# EAGLE design LACE_mod_led (EAGLE 5.07)
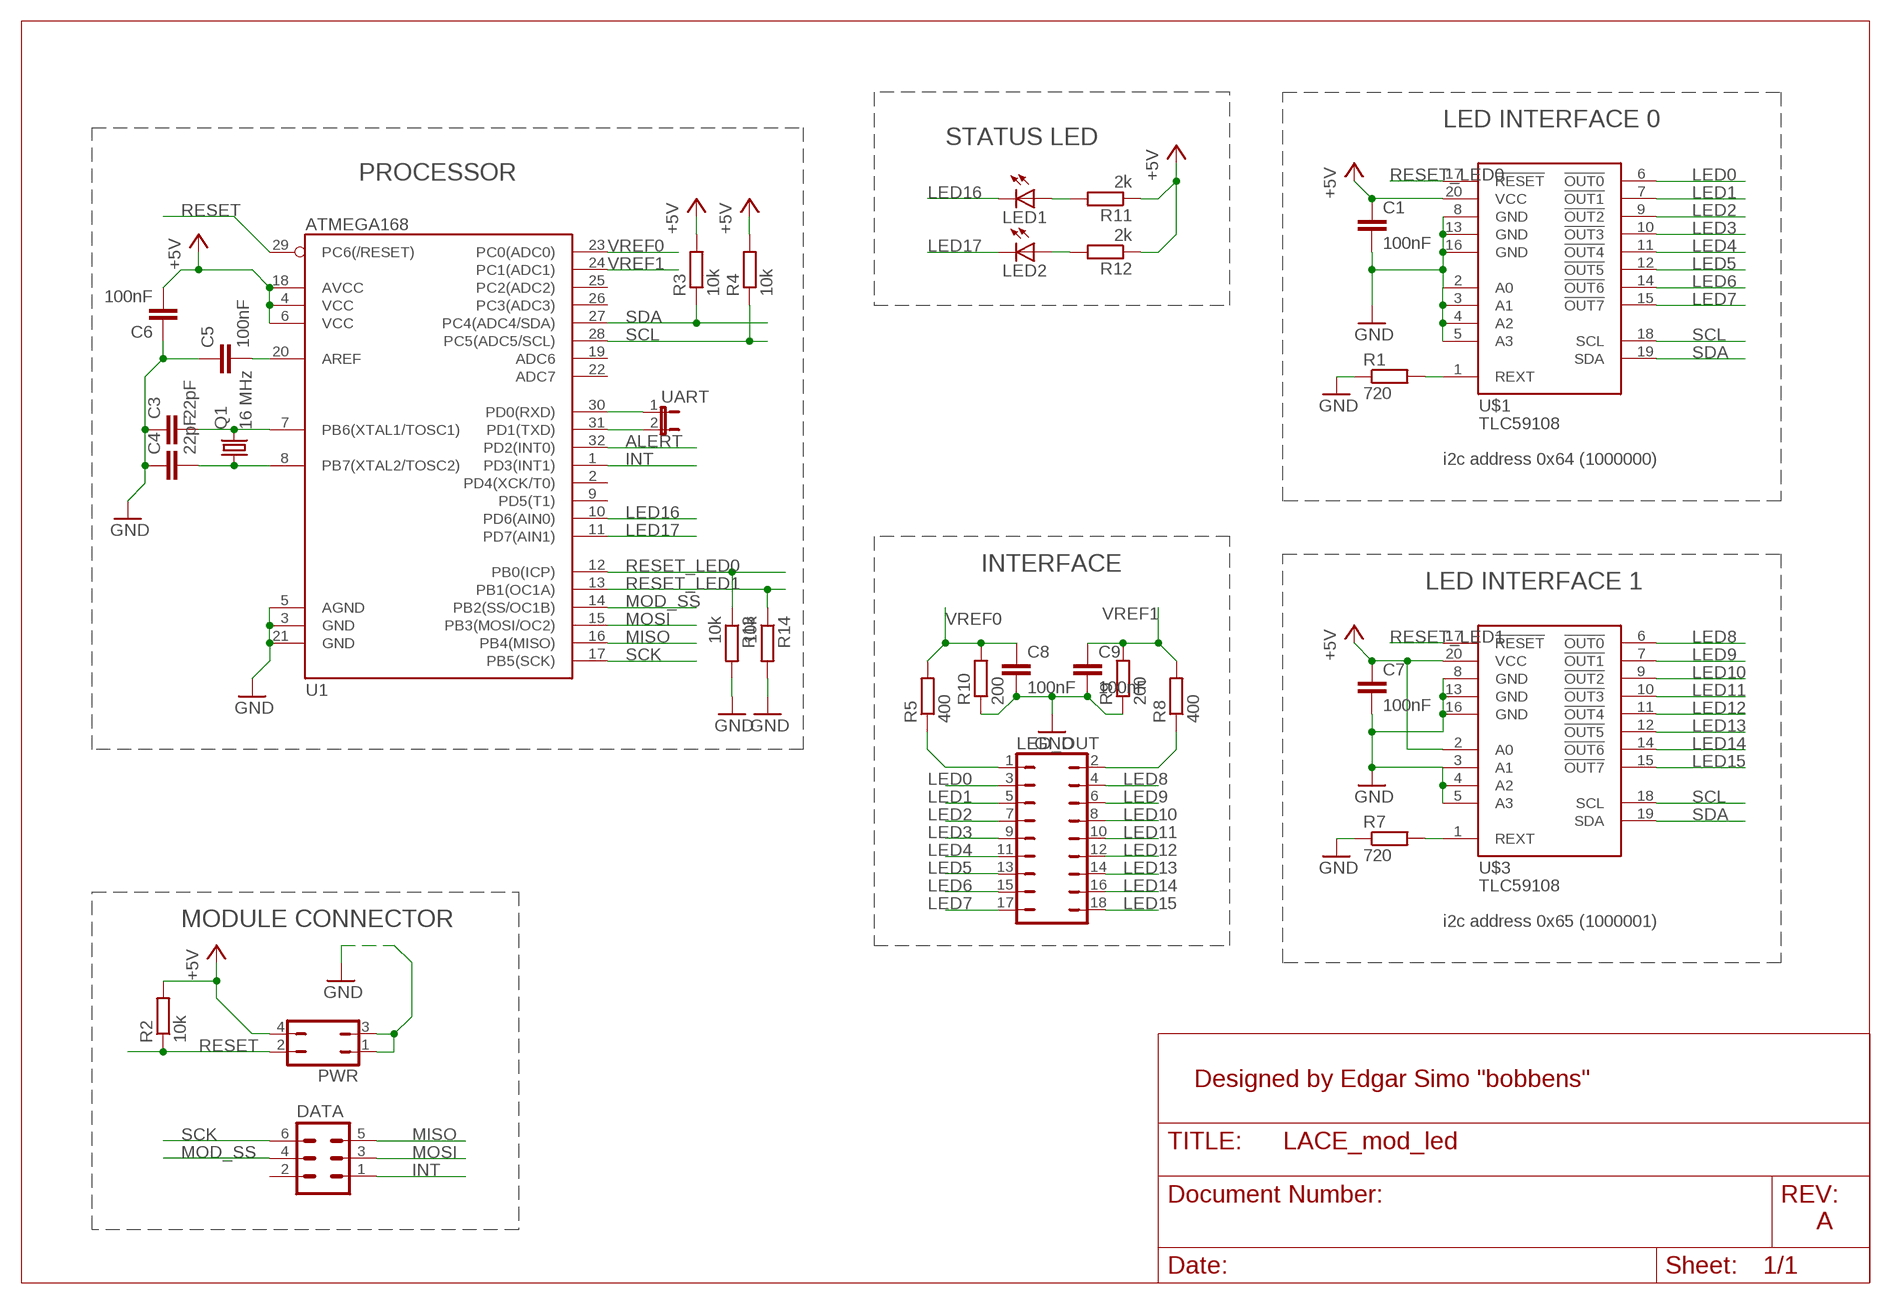
[diagram p0: schematic, sheet 1]

## Parts
C1  100nF  C-EUC0805  [C0805]
C3  22pF  C-EUC0805  [C0805]
C4  22pF  C-EUC0805  [C0805]
C5  100nF  C-EUC0805  [C0805]
C6  100nF  C-EUC0805  [C0805]
C7  100nF  C-EUC0805  [C0805]
C8  100nF  C-EUC0805  [C0805]
C9  100nF  C-EUC0805  [C0805]
DATA  MA03-2  [MA03-2]
LED1  LEDCHIPLED_0805  [CHIPLED_0805]
LED2  LEDCHIPLED_0805  [CHIPLED_0805]
LED_OUT  JP9Q  [JP9Q]
PWR  JP2Q  [JP2Q]
Q1  16 MHz  CRYSTALHC49S  [HC49/S]
R1  720  R-EU_R0805  [R0805]
R2  10k  R-EU_R0805  [R0805]
R3  10k  R-EU_R0805  [R0805]
R4  10k  R-EU_R0805  [R0805]
R5  400  R-EU_R0805  [R0805]
R7  720  R-EU_R0805  [R0805]
R8  400  R-EU_R0805  [R0805]
R9  200  R-EU_R0805  [R0805]
R10  200  R-EU_R0805  [R0805]
R11  2k  R-EU_R0805  [R0805]
R12  2k  R-EU_R0805  [R0805]
R13  10k  R-EU_R0805  [R0805]
R14  10k  R-EU_R0805  [R0805]
U1  ATMEGA168  [TQFP32-08]
U$1  TLC59108  [TSSOP20]
U$3  TLC59108  [TSSOP20]
UART  JP1E  [JP1]

## Nets
+5V: C1.1 C6.2 C7.1 PWR.4 R2.2 R3.2 R4.2 R11.1 R12.1 U1.4(VCC) U1.6(VCC) U1.18(AVCC) U$1.20(VCC) U$3.2(A0) U$3.20(VCC)
ALERT: U1.32(PD2(INT0))
GND: C1.2 C3.1 C4.1 C5.1 C6.1 C7.2 C8.2 C9.2 PWR.1 PWR.3 R1.1 R7.1 R9.1 R10.1 R13.2 R14.2 U1.3(GND) U1.5(AGND) U1.21(GND) U$1.2(A0) U$1.3(A1) U$1.4(A2) U$1.5(A3) U$1.8(GND) U$1.13(GND) U$1.16(GND) U$3.3(A1) U$3.4(A2) U$3.5(A3) U$3.8(GND) U$3.13(GND) U$3.16(GND)
INT: DATA.1 U1.1(PD3(INT1))
LED0: LED_OUT.3 U$1.6(!OUT0)
LED1: LED_OUT.5 U$1.7(!OUT1)
LED2: LED_OUT.7 U$1.9(!OUT2)
LED3: LED_OUT.9 U$1.10(!OUT3)
LED4: LED_OUT.11 U$1.11(!OUT4)
LED5: LED_OUT.13 U$1.12(!OUT5)
LED6: LED_OUT.15 U$1.14(!OUT6)
LED7: LED_OUT.17 U$1.15(!OUT7)
LED8: LED_OUT.4 U$3.6(!OUT0)
LED9: LED_OUT.6 U$3.7(!OUT1)
LED10: LED_OUT.8 U$3.9(!OUT2)
LED11: LED_OUT.10 U$3.10(!OUT3)
LED12: LED_OUT.12 U$3.11(!OUT4)
LED13: LED_OUT.14 U$3.12(!OUT5)
LED14: LED_OUT.16 U$3.14(!OUT6)
LED15: LED_OUT.18 U$3.15(!OUT7)
LED16: LED1.C U1.10(PD6(AIN0))
LED17: LED2.C U1.11(PD7(AIN1))
MISO: DATA.5 U1.16(PB4(MISO))
MOD_SS: DATA.4 U1.14(PB2(SS/OC1B))
MOSI: DATA.3 U1.15(PB3(MOSI/OC2))
N$1: C5.2 U1.20(AREF)
N$2: R1.2 U$1.1(REXT)
N$3: C3.2 Q1.2 U1.7(PB6(XTAL1/TOSC1))
N$4: C4.2 Q1.1 U1.8(PB7(XTAL2/TOSC2))
N$7: R7.2 U$3.1(REXT)
N$8: LED_OUT.1 R5.1
N$9: LED_OUT.2 R8.1
N$12: LED1.A R11.2
N$13: LED2.A R12.2
RESET: PWR.2 R2.1 U1.29(PC6(/RESET))
RESET_LED0: R13.1 U1.12(PB0(ICP)) U$1.17(!RESET)
RESET_LED1: R14.1 U1.13(PB1(OC1A)) U$3.17(!RESET)
RX: U1.30(PD0(RXD)) UART.1
SCK: DATA.6 U1.17(PB5(SCK))
SCL: R4.1 U1.28(PC5(ADC5/SCL)) U$1.18(SCL) U$3.18(SCL)
SDA: R3.1 U1.27(PC4(ADC4/SDA)) U$1.19(SDA) U$3.19(SDA)
TX: U1.31(PD1(TXD)) UART.2
VREF0: C8.1 R5.2 R10.2 U1.23(PC0(ADC0))
VREF1: C9.1 R8.2 R9.2 U1.24(PC1(ADC1))
Unconnected: DATA.2 U1.2(PD4(XCK/T0)) U1.9(PD5(T1)) U1.19(ADC6) U1.22(ADC7) U1.25(PC2(ADC2)) U1.26(PC3(ADC3))

## Notes on the sheet
- LED INTERFACE 0
- STATUS LED
- PROCESSOR
- i2c address 0x64 (1000000)
- INTERFACE
- LED INTERFACE 1
- MODULE CONNECTOR | i2c address 0x65 (1000001)
- Designed by Edgar Simo "bobbens"
- A

## Library data of the parts
C1 C3-C9 = rcl:C-EU: CAPACITOR, European symbol
DATA = con-lstb:MA03-2: PIN HEADER
LED1 LED2 = led:LED: LED OSRAM: - CHIPLED LG R971, LG N971, LY N971, LG Q971, LY Q971, LO R971, LY R971 LH N974, LH R974 LS Q976, LO Q976, LY Q976 LO Q996 - Hyper CHIPLED LW Q18S LB Q993, LB Q99A, LB R99A - SideLED LS A670, LO A670, LY A670, LG A670, LP A670 LB A673, LV A673, LT A673, LW A673 LH A674 LY A675 LS A676, LA A676, LO A676, LY A676, LW A676 LS A679, LY A679, LG A679 - Hyper Micro SIDELED® LS Y876, LA Y876, LO Y876, LY Y876 LT Y87S - SmartLED LW L88C, LW L88S LB L89C, LB L89S, LG L890 LS L89K, LO L89K, LY L89K LS L896, LA L896, LO L896, LY L896 - TOPLED LS T670, LO T670, LY T670, LG T670, LP T670 LSG T670, LSP T670, LSY T670, LOP T670, LYG T670 LG T671, LOG T671, LSG T671 LB T673, LV T673, LT T673, LW T673 LH T674 LS T676, LA T676, LO T676, LY T676, LB T676, LH T676, LSB T676, LW T676 LB T67C, LV T67C, LT T67C, LS T67K, LO T67K, LY T67K, LW E67C LS E67B, LA E67B, LO E67B, LY E67B, LB E67C, LV E67C, LT E67C LW T67C LS T679, LY T679, LG T679 LS T770, LO T770, LY T770, LG T770, LP T770 LB T773, LV T773, LT T773, LW T773 LH T774 LS E675, LA E675, LY E675, LS T675 LS T776, LA T776, LO T776, LY T776, LB T776 LHGB T686 LT T68C, LB T68C - Hyper Mini TOPLED® LB M676 - Mini TOPLED Santana® LG M470 LS M47K, LO M47K, LY M47K Source: http://www.osram.convergy.de LUXEON: - LUMILED® LXK2-PW12-R00, LXK2-PW12-S00, LXK2-PW14-U00, LXK2-PW14-V00 LXK2-PM12-R00, LXK2-PM12-S00, LXK2-PM14-U00 LXK2-PE12-Q00, LXK2-PE12-R00, LXK2-PE12-S00, LXK2-PE14-T00, LXK2-PE14-U00 LXK2-PB12-K00, LXK2-PB12-L00, LXK2-PB12-M00, LXK2-PB14-N00, LXK2-PB14-P00, LXK2-PB14-Q00 LXK2-PR12-L00, LXK2-PR12-M00, LXK2-PR14-Q00, LXK2-PR14-R00 LXK2-PD12-Q00, LXK2-PD12-R00, LXK2-PD12-S00 LXK2-PH12-R00, LXK2-PH12-S00 LXK2-PL12-P00, LXK2-PL12-Q00, LXK2-PL12-R00 Source: www.luxeon.com KINGBRIGHT: KA-3528ASYC Source: www.kingbright.com
LED_OUT = jumper:JP9Q: JUMPER
PWR = jumper:JP2Q: JUMPER
Q1 = crystal:CRYSTAL: CRYSTAL
R1-R5 R7-R14 = rcl:R-EU_: RESISTOR, European symbol
U1 = SparkFun:ATMEGA168
U$1 U$3 = bobbens:TLC59108: TLC59108 8-BIT Fm+ I2C-BUS CONSTANT-CURRENT LED SINK DRIVER
UART = jumper:JP1E: JUMPER

## Board
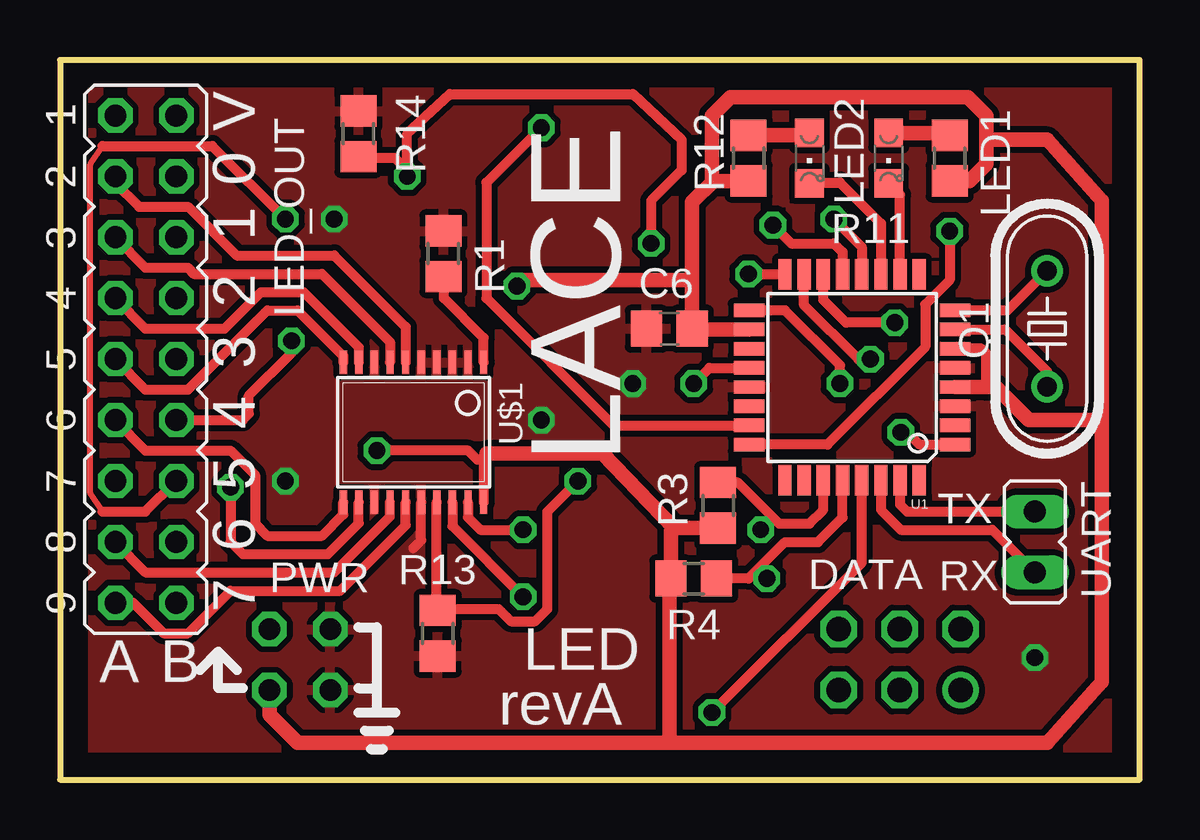
[diagram p1: board, top side]
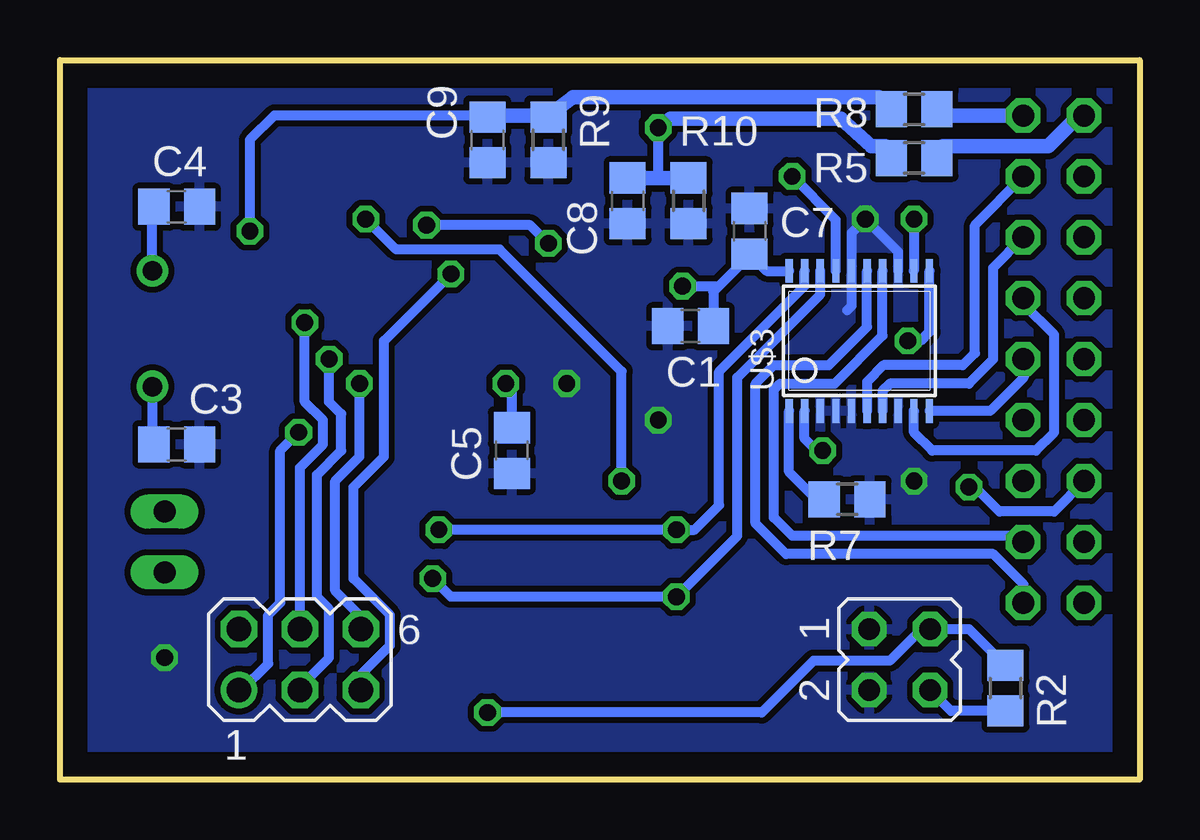
[diagram p2: board, bottom side, seen from below]

Size 45 x 30 mm. Coordinates in mm from the lower left corner, seen from the top.
Outline: 0,0 45,0 45,30 0,30 0,0
Copper layers (1*16): Top 0.035mm / dielectric 1.5mm / Bottom 0.035mm
Design rules "8mils *": minimum track width 8mil, minimum drill 0.7mm, track to track 8mil, track to pad 8mil, pad to pad 8mil, via to via 8mil, smd to smd 8mil, copper to edge 40mil, drill to drill 10mil, minimum pad ring 10mil, minimum via ring 8mil, stop-mask expansion 0mil, vias tented up to drill 0mil, thermal gap 10mil

### Footprints (pad centres in the part's own frame; a part is rotated, then mirrored left to right if it is on the bottom)
C0805 = smd 1.3 x 1.5: 1 -0.95,0; 2 0.95,0
MA03-2 = drill 1.016 round: 1 -2.54,-1.27 | drill 1.016 octagon: 2 -2.54,1.27; 3 0,-1.27; 4 0,1.27; 5 2.54,-1.27; 6 2.54,1.27
CHIPLED_0805 = smd 1.2 x 1.2: A 0,-1.05; C 0,1.05
JP9Q = drill 0.914 octagon: 1 -10.16,-1.27; 2 -10.16,1.27; 3 -7.62,-1.27; 4 -7.62,1.27; 5 -5.08,-1.27; 6 -5.08,1.27; 7 -2.54,-1.27; 8 -2.54,1.27; 9 0,-1.27; 10 0,1.27; 11 2.54,-1.27; 12 2.54,1.27; 13 5.08,-1.27; 14 5.08,1.27; 15 7.62,-1.27; 16 7.62,1.27; 17 10.16,-1.27; 18 10.16,1.27
JP2Q = drill 0.914 octagon: 1 -1.27,-1.27; 2 -1.27,1.27; 3 1.27,-1.27; 4 1.27,1.27
HC49/S = drill 0.813 round: 1 -2.413,0; 2 2.413,0
R0805 = smd 1.3 x 1.5: 1 -0.95,0; 2 0.95,0
TQFP32-08 = smd 1.27 x 0.559: 1 -4.293,2.8; 2 -4.293,2; 3 -4.293,1.2; 4 -4.293,0.4; 5 -4.293,-0.4; 6 -4.293,-1.2; 7 -4.293,-2; 8 -4.293,-2.8; 17 4.293,-2.8; 18 4.293,-2; 19 4.293,-1.2; 20 4.293,-0.4; 21 4.293,0.4; 22 4.293,1.2; 23 4.293,2; 24 4.293,2.8 | smd 0.559 x 1.27: 9 -2.8,-4.293; 10 -2,-4.293; 11 -1.2,-4.293; 12 -0.4,-4.293; 13 0.4,-4.293; 14 1.2,-4.293; 15 2,-4.293; 16 2.8,-4.293; 25 2.8,4.293; 26 2,4.293; 27 1.2,4.293; 28 0.4,4.293; 29 -0.4,4.293; 30 -1.2,4.293; 31 -2,4.293; 32 -2.8,4.293
TSSOP20 = smd 0.305 x 0.991: 1 -2.925,-2.918; 2 -2.275,-2.918; 3 -1.625,-2.918; 4 -0.975,-2.918; 5 -0.325,-2.918; 6 0.325,-2.918; 7 0.975,-2.918; 8 1.625,-2.918; 9 2.275,-2.918; 10 2.925,-2.918; 11 2.925,2.918; 12 2.275,2.918; 13 1.625,2.918; 14 0.975,2.918; 15 0.325,2.918; 16 -0.325,2.918; 17 -0.975,2.918; 18 -1.625,2.918; 19 -2.275,2.918; 20 -2.925,2.918
JP1 = drill 0.914 long: 1 0,-1.27; 2 0,1.27

### Placement (x,y rotation side)
C1  18.72,18.9 180 bottom
C3  40.13,13.97 180 bottom
C4  40.13,23.88 180 bottom
C5  26.16,13.72 90 bottom
C6  25.4,18.8 0 top
C7  16.26,22.86 90 bottom
C8  21.34,24.13 270 bottom
C9  27.18,26.67 270 bottom
DATA  35,5 0 bottom
LED1  34.54,25.91 180 top
LED2  31.24,25.91 180 top
LED_OUT  3.58,17.53 270 top
PWR  10,5 270 bottom
Q1  41.15,18.8 270 top
R1  15.99,21.92 270 top
R2  5.59,3.81 270 bottom
R3  27.43,11.43 270 top
R4  26.42,8.38 180 top
R5  9.4,25.91 180 bottom
R7  12.19,11.68 180 bottom
R8  9.4,27.94 180 bottom
R9  24.64,26.67 90 bottom
R10  18.8,24.13 90 bottom
R11  37.08,25.91 90 top
R12  28.7,25.91 90 top
R13  15.75,6.1 270 top
R14  12.45,26.92 90 top
U1  33.02,16.76 180 top
U$1  14.73,14.48 180 top
U$3  11.68,18.29 0 bottom
UART  40.64,9.91 0 top

### Tracks (layer width: path | path; a pad name or v marks a point on that pad's centre or on a via)
+5V  (via drill 0.7)
  Top 0.406: U1.6 38.42,17.96 38.61,17.78 38.61,16.36 | 17.66,13.34 U$1.20 | 17.78,13.59 17.66,13.34 | 17.66,13.34 17.39,13.34 17.02,13.72 v13.21,13.72
  Top 0.61: 27.24,24.96 R12.1 | 38.61,26.67 38.61,27.69 37.85,28.45 27.94,28.45 27.18,27.69 27.18,25.02 27.24,24.96 | 38.61,26.67 38.61,25.65 37.91,24.96 R11.1 | PWR.4 8.73,2.7 9.91,1.52 25.4,1.52 | 43.43,14.99 43.43,4.06 41.15,1.52 25.4,1.52 | 43.43,14.99 43.43,24.13 41.15,26.67 38.61,26.67 | U1.4 38.61,16.36 39.01,16.36 40.39,14.99 43.43,14.99 | 17.78,13.59 22.61,13.59 25.59,10.48 | U1.18 26.38,18.76 C6.2 26.35,20.83 | v19.05,20.57 19.3,20.83 26.35,20.83 | 26.35,20.83 26.35,24.06 27.24,24.96 | 25.59,10.48 R3.2 | 25.59,10.48 25.47,10.36 R4.2 25.4,8.38 25.4,1.52
  Bottom 0.406: R2.2 7.86,2.86 PWR.4 | U$3.20 15.55,21.21 C7.1 16.26,21.84 17.53,20.57 | U$3.2 13.96,14.21 13.46,13.72 v13.21,13.72 | v19.05,20.57 17.53,20.57 | C1.1 17.77,20.33 17.53,20.57
GND  (via drill 0.7)
  Top 0.406: U$1.16 15.06,9.98 14.73,9.65
  Bottom 0.406: U$3.13 10.06,22 v11.43,23.37 12.01,22.79 U$3.16 12.01,19.74 12.19,19.56
  other vias: 9.4,12.45 40.64,5.08 20.07,14.99 23.88,16.51
  pour Bottom (isolate 0.254): -0.51,-0.25 -0.51,30.48 45.47,30.48 45.47,30.23 45.21,30.23 45.21,-0.76
  pour Top (isolate 0.254): 0.25,0.25 0.25,29.72 44.7,29.72 44.7,0.25
INT  (via drill 0.7)
  Top 0.406: v35.05,14.48 35.31,14.48 35.81,13.97 U1.1
  Bottom 0.406: DATA.1 37.42,3.73 36.32,4.83 36.32,6.86 35.81,7.37 35.81,13.72 v35.05,14.48
LED0
  Top 0.406: LED_OUT.3 2.29,24.89 3.3,23.88 5.33,23.88 7.37,21.84 11.43,21.84 14.41,18.87 U$1.6
LED1
  Top 0.406: U$1.7 13.76,18.25 10.92,21.08 5.59,21.08 5.33,21.34 3.56,21.34 LED_OUT.5
LED2
  Top 0.406: U$1.9 12.46,18.02 10.16,20.32 8.38,20.32 6.86,18.8 3.56,18.8 LED_OUT.7
LED3
  Top 0.406: U$1.10 11.81,17.66 9.91,19.56 8.64,19.56 5.33,16.26 3.56,16.26 LED_OUT.9
LED4
  Top 0.406: LED_OUT.11 3.56,13.72 7.11,13.72 8.13,12.7 8.13,10.67 8.64,10.16 10.92,10.16 11.81,11.04 U$1.11
LED5  (via drill 0.7)
  Top 0.406: U$1.12 12.46,10.68 11.18,9.4 7.62,9.4 7.11,9.91 v7.11,12.19
  Bottom 0.406: v7.11,12.19 6.86,12.19 5.84,11.18 3.56,11.18 LED_OUT.13
LED6
  Top 0.406: U$1.14 13.76,10.96 11.43,8.64 3.56,8.64 LED_OUT.15
LED7
  Top 0.406: LED_OUT.17 3.05,7.37 4.32,6.1 5.33,6.1 7.11,7.87 11.68,7.87 14.41,10.6 U$1.15
LED8
  Bottom 0.406: LED_OUT.4 6.86,23.11 6.86,17.78 7.37,17.27 10.67,17.27 11.36,16.58 U$3.6
LED9
  Bottom 0.406: LED_OUT.6 6.1,21.34 6.1,17.53 7.11,16.51 10.41,16.51 10.71,16.21 U$3.7
LED10
  Bottom 0.406: LED_OUT.8 4.83,19.81 3.56,18.54 3.56,14.48 4.32,13.72 8.64,13.72 9.4,14.48 9.4,15.36 U$3.9
LED11
  Bottom 0.406: U$3.10 6.22,15.37 4.83,16.76 LED_OUT.10
LED12  (via drill 0.7)
  Top 0.406: LED_OUT.12 7.62,14.99 7.87,15.24 7.87,16 9.65,17.78 v9.65,18.29
  Bottom 0.406: v9.65,18.29 9.14,18.29 8.76,18.67 U$3.11
LED13  (via drill 0.7)
  Top 0.254: 1.78,26.42 1.27,25.65 1.27,11.94 1.78,11.18
  Top 0.406: v9.4,23.37 6.35,26.42 1.78,26.42 | 1.78,11.18 3.56,11.18 LED_OUT.14
  Bottom 0.406: U$3.12 9.41,23.36 v9.4,23.37
LED14
  Bottom 0.406: U$3.14 10.71,18.5 12.7,16.51 14.99,16.51 15.24,16.26 15.24,10.92 14.48,10.16 5.08,10.16 LED_OUT.16
LED15
  Bottom 0.406: U$3.15 11.36,18.87 12.95,17.27 15.24,17.27 16,16.51 16,10.67 14.73,9.4 6.1,9.4 4.83,8.13 LED_OUT.18
LED16
  Top 0.406: U1.10 35.02,24.38 LED1.C
LED17
  Top 0.406: U1.11 34.22,23.18 32.51,24.89 31.28,24.89 LED2.C
MISO  (via drill 0.7)
  Top 0.406: v28.7,21.08 30.2,21.08 U1.16
  Bottom 0.406: DATA.5 32.46,4.37 31.24,5.59 31.24,6.86 32.77,8.38 32.77,12.19 31.5,13.46 31.5,18.29 v28.7,21.08
MOD_SS  (via drill 0.7)
  Top 0.406: v34.8,19.05 32.77,19.05 31.82,20 U1.14
  Bottom 0.406: 35,18.85 v34.8,19.05 34.8,15.75 34.04,14.99 34.04,13.97 35,13.01 DATA.4
MOSI  (via drill 0.7)
  Top 0.406: v33.78,17.53 33.27,17.53 31.02,19.78 U1.15
  Bottom 0.406: DATA.3 35,3.86 33.78,5.08 33.78,7.11 34.29,7.62 34.29,12.7 33.27,13.72 33.27,15.24 33.78,15.75 v33.78,17.53
N$1  (via drill 0.7)
  Top 0.406: U1.20 27.07,17.16 v26.42,16.51
  Bottom 0.406: C5.2 26.16,16.26 v26.42,16.51
N$2
  Top 0.406: U$1.1 17.66,18.41 16,20.07 16,20.96 R1.2
N$3
  Top 0.406: U1.7 39.4,18.76 41.15,17.02 Q1.2
  Bottom 0.406: Q1.2 41.15,14.04
  Bottom 0.61: 41.15,14.04 C3.2
N$4
  Top 0.406: U1.8 39.5,19.56 Q1.1
  Bottom 0.406: Q1.1 41.15,23.81
  Bottom 0.61: 41.15,23.81 C4.2
N$7
  Bottom 0.406: R7.2 13.46,11.68 14.61,12.83 U$3.1
N$8
  Bottom 0.61: LED_OUT.1 2.54,27.69 3.81,26.42 8.19,26.42 R5.1
N$9
  Bottom 0.61: LED_OUT.2 7.94,27.69 R8.1
N$12
  Top 0.61: LED1.A 36.98,26.96 R11.2
N$13
  Top 0.61: R12.2 31.14,26.86 LED2.A
RESET  (via drill 0.7)
  Top 0.406: U1.29 33.42,9.04 v27.18,2.79
  Bottom 0.406: R2.1 7.1,6.27 PWR.2 9.1,6.27 10.41,4.95 13.59,4.95 15.75,2.79 v27.18,2.79
RESET_LED0  (via drill 0.7)
  Top 0.406: U1.12 33.42,22.21 v32.26,23.37 | U$1.17 15.71,7.09 R13.1 15.81,7.11 18.29,7.11 18.8,6.6 19.81,6.6 20.32,7.11 20.32,11.18 v21.59,12.45
  Bottom 0.406: v32.26,23.37 30.99,22.1 26.67,22.1 21.59,17.02 v21.59,12.45
RESET_LED1  (via drill 0.7)
  Top 0.406: U1.13 32.62,21.99 32.26,22.35 30.48,22.35 v29.72,23.11 | R14.1 12.51,25.91 13.97,25.91 14.48,25.4 v14.48,25.15 14.48,26.92 16.26,28.57 23.88,28.57 25.91,26.67 25.91,25.4 24.64,24.13 v24.64,22.35
  Bottom 0.406: U$3.17 12.66,23.33 v14.48,25.15 | v29.72,23.11 25.4,23.11 v24.64,22.35
RX
  Top 0.406: U1.30 34.22,11.25 35.05,10.41 38.86,10.41 UART.1
SCK  (via drill 0.7)
  Top 0.406: v32.51,16.51 32.51,17.27 30.23,19.56 U1.17
  Bottom 0.406: 32.46,16.46 v32.51,16.51 32.51,13.46 33.53,12.45 33.53,7.87 32.46,6.81 DATA.6
SCL  (via drill 0.7)
  Top 0.406: U1.28 32.62,10.92 31.6,9.91 30.23,9.91 29.08,8.76 | U$1.18 16.36,10.57 v19.3,7.62 | R4.1 28.7,8.38 29.08,8.76 | v29.46,8.38 29.08,8.76
  Bottom 0.406: v29.46,8.38 28.7,7.62 v19.3,7.62 16.76,10.16 16.76,16.76 13.31,20.22 U$3.18
SDA  (via drill 0.7)
  Top 0.406: U1.27 31.82,11.25 31.24,10.67 29.97,10.67 29.72,10.92 | R3.1 28.26,12.38 29.72,10.92 | v29.21,10.41 29.72,10.92 | U$1.19 17.01,10.93 17.53,10.41 v19.3,10.41
  Bottom 0.406: U$3.19 13.96,20.57 17.53,17.01 17.53,11.43 18.54,10.41 v19.3,10.41 v29.21,10.41
TX
  Top 0.406: UART.2 35.31,11.18 35.02,11.46 U1.31
VREF0  (via drill 0.7)
  Top 0.406: U1.23 23.08,14.76 17.78,20.07 17.78,24.89 v20.07,27.18
  Bottom 0.406: v20.07,27.18 20.07,25.08
  Bottom 0.61: R10.2 20.07,25.08 C8.1 | R5.2 10.6,26.42 11.18,26.42 12.45,27.56 19.56,27.56 v20.07,27.18
VREF1  (via drill 0.7)
  Top 0.406: v37.08,22.86 37.08,20.83 36.07,19.81 36.07,18.03 32,13.96 U1.24
  Bottom 0.406: v37.08,22.86 37.08,26.67 36.07,27.69 27.24,27.69 C9.1
  Bottom 0.61: C9.1 27.11,27.69 24.7,27.69 | 24.7,27.69 R9.2 | 24.7,27.69 24.64,27.69 23.62,28.45 10.86,28.45 R8.2

### Text on the board
tNames: V | 0 | 1 | 2 | 3 | 4 | 5 | LACE | TX | 6 | RX | 7 | A | B | LED | revA